# Altium schematic sheet gydrodrive_supply.SchDoc
size 297 x 209 mm; SheetNumber: 4; SheetTotal: 22
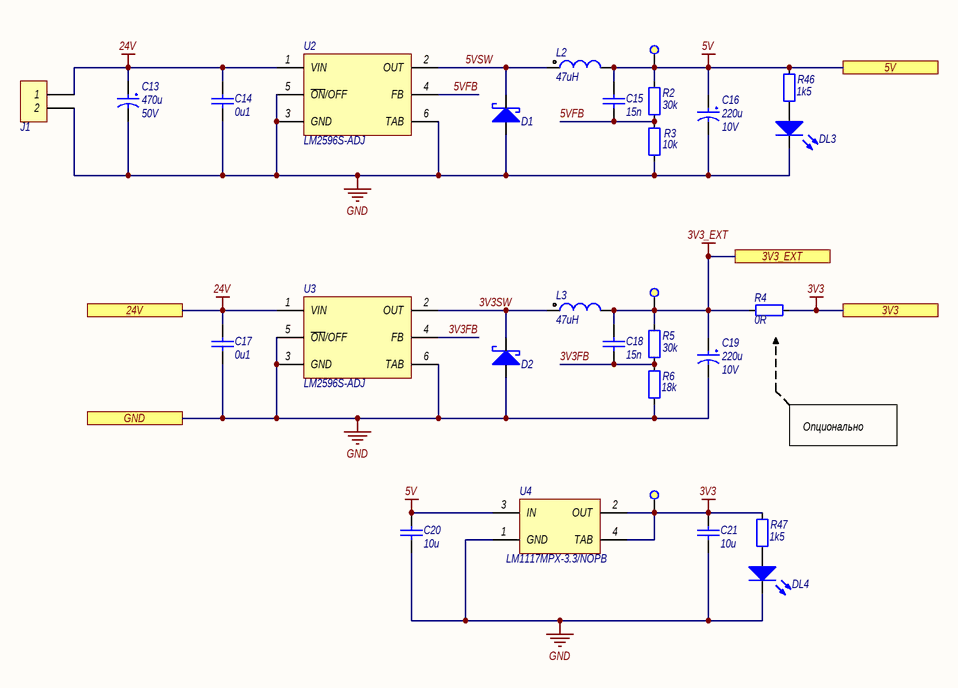
[diagram p0: gydrodrive_supply.SchDoc]

## Parts
C13  Capacitance: 470u  Voltage: 50V  [ECAP1020]  (hidden comment: JRB1H471M05001000200000B)
C14  Capacitance: 0u1  [CAPC2012-0805M]  (hidden comment: CAP_0805)
C15  Capacitance: 15n  [CAPC2012-0805M]  (hidden comment: CAP_0805)
C16  Capacitance: 220u  Voltage: 10V  [ECAP6.37]  (hidden comment: JRK1A221M02500630070000B)
C17  Capacitance: 0u1  [CAPC2012-0805M]  (hidden comment: CAP_0805)
C18  Capacitance: 15n  [CAPC2012-0805M]  (hidden comment: CAP_0805)
C19  Capacitance: 220u  Voltage: 10V  [ECAP6.37]  (hidden comment: JRK1A221M02500630070000B)
C20  Capacitance: 10u  [CAPC2012-0805M]  (hidden comment: CAP_0805)
C21  Capacitance: 10u  [CAPC2012-0805M]  (hidden comment: CAP_0805)
D1  SK56  [SMB_M]  (value not drawn)
D2  SK56  [SMB_M]  (value not drawn)
DL3  LED_0805  [LEDC2012-0805M]  (value not drawn)
DL4  LED_0805  [LEDC2012-0805M]  (value not drawn)
J1  DG142V-5.08-02P  [DG142V-5.08-02P]  (value not drawn)
L2  Inductance: 47uH  [IND_IHL4040_M]  (hidden comment: IHLP4040DZER470M11)
L3  Inductance: 47uH  [IND_IHL4040_M]  (hidden comment: IHLP4040DZER470M11)
R2  Resistance: 30k  [RESC2012-0805M]  (hidden comment: RES_0805)
R3  Resistance: 10k  [RESC2012-0805M]  (hidden comment: RES_0805)
R4  Resistance: 0R  [RESC2012-0805M]  (hidden comment: RES_0805)
R5  Resistance: 30k  [RESC2012-0805M]  (hidden comment: RES_0805)
R6  Resistance: 18k  [RESC2012-0805M]  (hidden comment: RES_0805)
R46  Resistance: 1k5  [RESC2012-0805M]  (hidden comment: RES_0805)
R47  Resistance: 1k5  [RESC2012-0805M]  (hidden comment: RES_0805)
TP2  Test point 2  [TP_2]  (value not drawn)  (no BOM)
TP3  Test point 2  [TP_2]  (value not drawn)  (no BOM)
TP4  Test point 2  [TP_2]  (value not drawn)  (no BOM)
U2  LM2596S-ADJ  [TO-263-5M]
U3  LM2596S-ADJ  [TO-263-5M]
U4  LM1117MPX-3.3/NOPB  [SOT223M]

## Ports
3V3 (see gydrodrive_main[1C], gydrodrive_button[2B], gydrodrive_can[3B], gydrodrive_debugger[2B], gydrodrive_encoder[1A], gydrodrive_indication[3C], gydrodrive_inputTrim[2B], gydrodrive_interfaces[3C], gydrodrive_mcu[4C], gydrodrive_rs485[4B], gydrodrive_sto[2B]), 3V3_EXT (see gydrodrive_main[1C], gydrodrive_i2c[5B], gydrodrive_interfaces[3A], gydrodrive_reservedPins[2B], gydrodrive_uart[4B]), 5V (see gydrodrive_main[1C], gydrodrive_can[4B], gydrodrive_currentSource[2C], gydrodrive_discreteControl[3B], gydrodrive_interfaces[3C]), 24V (see gydrodrive_main[1C], gydrodrive_button[2B], gydrodrive_control[2B], gydrodrive_currentSource[2B], gydrodrive_discreteControl[4B], gydrodrive_encoder[3B], gydrodrive_linearPosSensor[3B], gydrodrive_sensor[3B], gydrodrive_sensors[2B], gydrodrive_sto[3B]), GND (see gydrodrive_main[1C], gydrodrive_button[2C], gydrodrive_can[3C], gydrodrive_control[2C], gydrodrive_currentSource[2B], gydrodrive_debugger[3C], gydrodrive_discreteControl[3B], gydrodrive_encoder[1B], gydrodrive_i2c[5C], gydrodrive_indication[3C], gydrodrive_inputTrim[2C], gydrodrive_interfaces[3A], gydrodrive_linearPosSensor[2C], gydrodrive_mcu[6D], gydrodrive_reservedPins[2C], gydrodrive_rs485[3B], gydrodrive_sensor[3C], gydrodrive_sensors[2B], gydrodrive_sto[2C], gydrodrive_uart[4C])

## Nets
3V3: C21.2 R4.1 R47.2 TP4.1 U4.2(OUT) U4.4(TAB) ; port 3V3
3V3_EXT: C18.1 C19.1 L3.2 R4.2 R5.2 TP3.1 ; port 3V3_EXT
5V: C15.1 C16.1 C20.2 L2.2 R2.2 R46.2 TP2.1 U4.3(IN) ; port 5V
24V: C13.1 C14.2 C17.2 J1.1 U2.1(VIN) U3.1(VIN) ; port 24V
GND: C13.2 C14.1 C16.2 C17.1 C19.2 C20.1 C21.1 D1.2(A) D2.2(A) DL3.1(K) DL4.1(K) J1.2 R3.1 R6.1 U2.3(GND) U2.5(~{ON}/OFF) U2.6(TAB) U3.3(GND) U3.5(~{ON}/OFF) U3.6(TAB) U4.1(GND) ; port GND
3V3FB: C18.2 R5.1 R6.2 U3.4(FB)
3V3SW: D2.1(K) L3.1 U3.2(OUT)
5VFB: C15.2 R2.1 R3.2 U2.4(FB)
5VSW: D1.1(K) L2.1 U2.2(OUT)
NetDL3_2: DL3.2(A) R46.1
NetDL4_2: DL4.2(A) R47.1

## Notes on the sheet
- Опционально
- Подп. и дата
- Инв. № дубл.
- Взам. инв. №
- Инв. № подл.
- Изм.
- Лист
- № докум.
- Подп.
- Дата
- Копировал
- Формат
- A4

## Library data of the parts
C13 = JRB1H471M05001000200000B: Конденсатор электролитический; Part Name: Конд-р электрол.  JRB1H471M05001000200000B, 470uF, 50V; Parameters: 470uF, 50V; Max Price: 30; Part Number: JRB1H471M05001000200000B; Component Type: Standart
C14 C17 = CAPC_0805: Конденсатор керамический, корпус 0805; Parameters: 0u1,  50V; Voltage: 50V; Max Price: 5; Part Number: CAPC_0805; Part Name: ='Конд-р керам. 0805,  '  + Parameters; Component Type: Standart; Pin Count: 2
C15 C18 = CAPC_0805: Конденсатор керамический, корпус 0805; Parameters: 15n,  50V; Voltage: 50V; Max Price: 5; Part Number: CAPC_0805; Part Name: ='Конд-р керам. 0805,  '  + Parameters; Component Type: Standart; Pin Count: 2
C16 C19 = JRK1A221M02500630070000B: Конденсатор электролитический; Part Name: Конд-р электрол.  JRK1A221M02500630070000B, 220uF, 10V; Parameters: 220uF, 10V; Max Price: 20; Part Number: JRK1A221M02500630070000B; Component Type: Standart
C20 C21 = CAPC_0805: Конденсатор керамический, корпус 0805; Parameters: 10u,  16V; Voltage: 16V; Max Price: 5; Part Number: CAPC_0805; Part Name: ='Конд-р керам. 0805,  '  + Parameters; Component Type: Standart; Pin Count: 2
D1 D2 = SK56: Диод Шоттки; Part Name: Диод Шоттки SK56; Parameters: 60V, 5A; Voltage: 60V; Current: 5A; Max Price: 50; Part Number: SK56; Component Type: Standart; Pin Count: 2
DL3 DL4 = LED_0805: Светодиод smd, корпус 0805; Part Name: Светодиод smd 0805; Parameters: Желтый; Max Price: 0; Part Number: LED_0805; Component Type: Standart; Pin Count: 2
J1 = DG142V-5.08-02P: Клеммник 2-контактный, шаг 5.08 мм; Part Name: Клеммник DG142V-5.08-02P; Parameters: 8А; Max Price: 60; System: Connector; Part Number: DG142V-5.08-02P; Component Type: Standart; Pin Count: 2
L2 L3 = IHLP4040DZER470M11: Индуктивность силовая; Part Name: Индуктивность IHLP4040DZER470M11; Current: 3A; Max Price: 100; Part Number: IHLP4040DZER470M11; Component Type: Standart; Pin Count: 2; Parameters: 47uH
R2 R5 = RESC_0805: Рез-р, корпус 0805; Tolerance: 5%; Parameters: 30k, 5%; Max Price: 3; Part Number: RESC_0805; Part Name: ='Рез-р 0805, ' + Parameters; Component Type: Standart
R3 = RESC_0805: Рез-р, корпус 0805; Tolerance: 5%; Parameters: 10k, 5%; Max Price: 3; Part Number: RESC_0805; Part Name: ='Рез-р 0805, ' + Parameters; Component Type: Standart
R4 = RESC_0805: Рез-р, корпус 0805; Tolerance: 5%; Parameters: 0R, 5%; Max Price: 3; Part Number: RESC_0805; Part Name: ='Рез-р 0805, ' + Parameters; Component Type: Standart
R6 = RESC_0805: Рез-р, корпус 0805; Tolerance: 5%; Parameters: 18k, 5%; Max Price: 3; Part Number: RESC_0805; Part Name: ='Рез-р 0805, ' + Parameters; Component Type: Standart
R46 R47 = RESC_0805: Рез-р, корпус 0805; Tolerance: 5%; Parameters: 1k5, 5%; Max Price: 3; Part Number: RESC_0805; Part Name: ='Рез-р 0805, ' + Parameters; Component Type: Standart
TP2-TP4 = Test point 2: Тестовый контакт круглый 2 мм; Part Number: Test point 2; Part Name: Тестовый контакт; Component Type: Standart (No BOM)
U2 U3 = LM2596S-ADJ: DC-DC преобразователь; Part Name: DC-DC преобразователь LM2596S-ADJ; Parameters: 40V, 1.23..37V, 3A, 150kHz; Max Price: 600; ComponentLink1Description: LM2596 Datasheet; ComponentLink1URL: http://www.national.com/ds/LM/LM2596.pdf; ComponentLink3Description: TS5B Package Page; ComponentLink3URL: http://www.national.com/packaging/folders/ts5b.html; Part Number: LM2596S-ADJ; Component Type: Standart; HelpURL: https://www.ti.com/lit/ds/symlink/lm2596.pdf
U4 = LM1117MPX-3.3/NOPB: Линейный регулятор с низким падением напряжения; Part Name: Линейный регулятор LM1117MPX-3.3/NOPB; Parameters: 3.3V, 800mA; Max Price: 250; Part Number: LM1117MPX-3.3/NOPB; Component Type: Standart; Pin Count: 4; HelpURL: https://static.chipdip.ru/lib/666/DOC012666144.pdf